# Altium schematic sheet DSR_Altium_Schematic_NOTTESTED.schdoc
size 320 x 219 mm
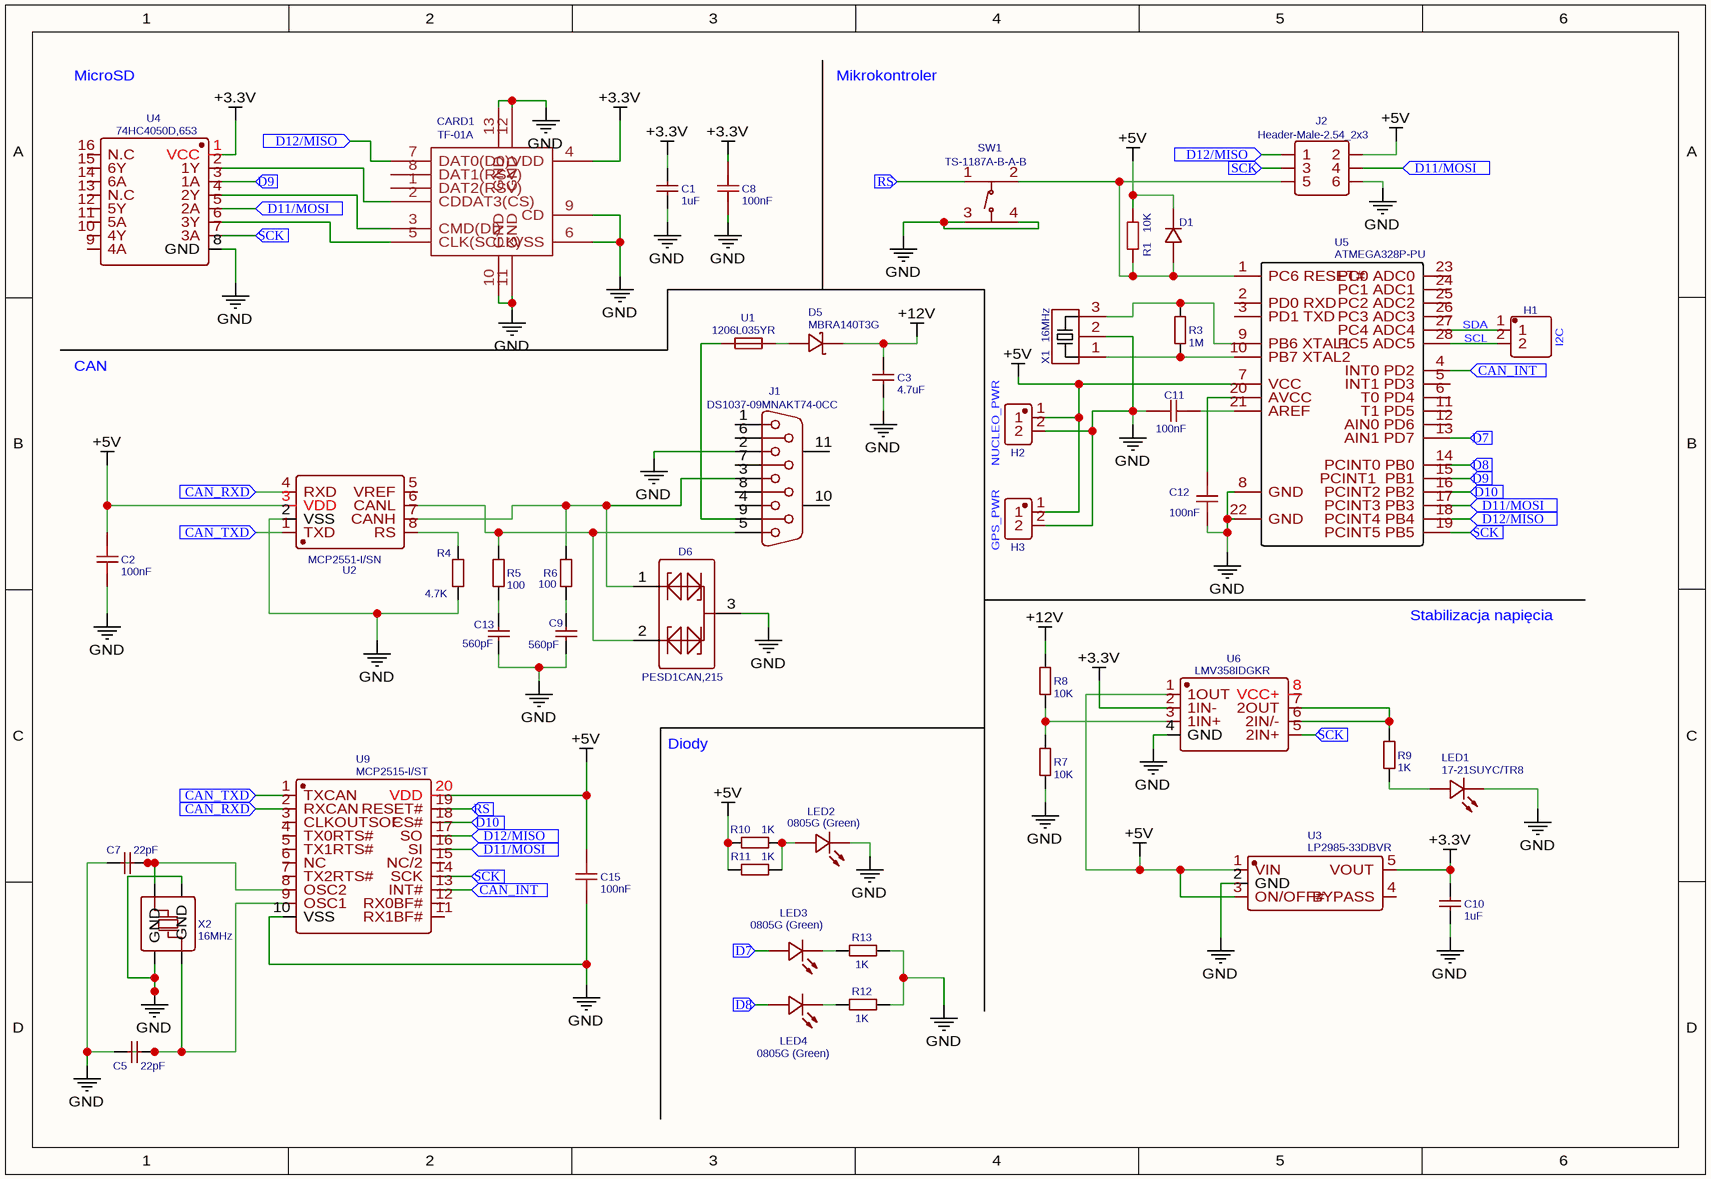
[diagram p0: DSR_Altium_Schematic_NOTTESTED.schdoc]

## Parts
C1  1uF  [C0603]
C2  100nF  [C0603]
C3  4.7uF  [C0603]
C5  22pF  [C0603]
C7  22pF  [C0603]
C8  100nF  [C0603]
C9  560pF  [C0603]
C10  1uF  [C0603]
C11  100nF  [C0603]
C12  100nF  [C0603]
C13  560pF  [C0603]
C15  100nF  [C0603]
CARD1  TF-01A  [TF-SMD_TF-01A]
D1  CD1206-S01575  [D1206-RD]  (value not drawn)
D5  MBRA140T3G  [SMA_L4.3-W2.6-LS5.2-RD]
D6  PESD1CAN,215  [SOT-23_L2.9-W1.3-P1.90-LS2.4-BR]
H1  210S-1*2P L=11.6MMGold-plated black  [HDR-TH_2P-P2.54-V-M-1]  (value not drawn)
H2  22850102ANG1SYA02  [HDR-TH_2P-P2.54-V-F]  (value not drawn)
H3  22850102ANG1SYA02  [HDR-TH_2P-P2.54-V-F]  (value not drawn)
J1  DS1037-09MNAKT74-0CC  [DB9-TH_DT10121-M5N3-4F]
J2  Header-Male-2.54_2x3  [HDR-TH_6P-P2.54-V-M-R2-C3-S2.54-1]
LED1  17-21SUYC/TR8  [LED0805-RD]
LED2  0805G (Green)  [LED0805-RD_GREEN]
LED3  0805G (Green)  [LED0805-RD_GREEN]
LED4  0805G (Green)  [LED0805-RD_GREEN]
R1  10K  [R0603]
R3  1M  [R0603]
R4  4.7K  [R0603]
R5  100  [R0603]
R6  100  [R0603]
R7  10K  [R0603]
R8  10K  [R0603]
R9  1K  [R0603]
R10  1K  [R0603]
R11  1K  [R0603]
R12  1K  [R0603]
R13  1K  [R0603]
SW1  TS-1187A-B-A-B  [SW-SMD_4P-L5.1-W5.1-P3.70-LS6.5-TL-2]
U1  1206L035YR  [F1206]
U2  MCP2551-I/SN  [SOIC-8_L4.9-W3.9-P1.27-LS6.0-BL]
U3  LP2985-33DBVR  [SOT-23-5_L2.9-W1.6-P0.95-LS2.8-TL]
U4  74HC4050D,653  [SOP-16_L10.0-W3.9-P1.27-LS6.0-BL]
U5  ATMEGA328P-PU  [DIP-28_L34.6-W7.3-P2.54-LS10.2-BL]
U6  LMV358IDGKR  [VSSOP-8_L3.0-W3.0-P0.65-LS5.0-BL]
U9  MCP2515-I/ST  [TSSOP-20_L6.5-W4.4-P0.65-LS6.4-BL]
X1  16MHz  [OSC-SMD_3P-L3.2-W1.3-P0.95-L]
X2  16MHz  [CRYSTAL-SMD_4P-L5.0-W3.2-BL]

## Ports
CAN_INT (in), CAN_RXD (in), CAN_TXD (in), D7 (in), D8 (in), D9 (in), D10 (in), D11/MOSI (in), D12/MISO (in), RS (in), SCK (in)

## Nets
+3.3V: C1.2 C8.2 C10.2 CARD1.4(VDD) U3.5(VOUT) U4.1(VCC) U6.2(1IN-)
+5V: C2.2 C15.2 D1.1(K) H2.1 H3.1 J2.2 R1.2 R10.2 R11.2 U2.3(VDD) U3.1(VIN) U3.3(ON/OFF#) U5.7(VCC) U6.1(1OUT) U9.20(VDD)
+12V: C3.2 D5.1(C) R8.2
GND: C1.1 C2.1 C3.1 C5.1 C7.1 C8.1 C9.1 C10.1 C11.2 C12.1 C13.1 C15.1 CARD1.6(VSS) CARD1.9(CD) CARD1.10(GND) CARD1.11(GND) CARD1.12(GND) CARD1.13(GND) D6.3 H2.2 H3.2 J1.2 J2.6 LED1.1(-) LED2.1(K) R4.2 R7.1 R12.2 R13.2 SW1.3(C) SW1.4(D) U2.2(VSS) U3.2(GND) U4.8(GND) U5.8(GND) U5.22(GND) U6.4(GND) U9.10(VSS) X1.2 X2.2(GND) X2.4(GND)
CAN_INT: U5.4(INT0_PD2) U9.13(INT#) ; port CAN_INT
CAN_RXD: U2.4(RXD) U9.2(RXCAN) ; port CAN_RXD
CAN_TXD: U2.1(TXD) U9.1(TXCAN) ; port CAN_TXD
D7: LED3.2(A) U5.13(AIN1_PD7) ; port D7
D8: LED4.2(A) U5.14(PCINT0_PB0) ; port D8
D9: U4.3(1A) U5.15(PCINT1__PB1) ; port D9
D10: U5.16(PCINT2_PB2) U9.18(CS#) ; port D10
D11/MOSI: J2.4 U4.5(2A) U5.17(PCINT3_PB3) U9.16(SI) ; port D11/MOSI
D12/MISO: CARD1.7(DAT0(D0)) J2.1 U5.18(PCINT4_PB4) U9.17(SO) ; port D12/MISO
RS: SW1.1(A) U9.19(RESET#) ; port RS
SCK: J2.3 U4.7(3A) U5.19(PCINT5_PB5) U6.5(2IN+) U9.14(SCK) ; port SCK
NetC5_2: C5.2 U9.9(OSC1) X2.1(OSC1)
NetC7_2: C7.2 U9.8(OSC2) X2.3(OSC2)
NetC9_2: C9.2 R6.1
NetC11_1: C11.1 U5.21(AREF)
NetC12_2: C12.2 U5.20(AVCC)
NetC13_2: C13.2 R5.1
NetCARD1_2: CARD1.2(CDDAT3(CS)) U4.2(1Y)
NetCARD1_3: CARD1.3(CMD(DI)) U4.4(2Y)
NetCARD1_5: CARD1.5(CLK(SCLK)) U4.6(3Y)
NetD1_2: D1.2(A) J2.5 R1.1 SW1.2(B) U5.1(PC6_RESET#)
NetD5_2: D5.2(A) U1.2
NetD6_1: D6.1 J1.3 R6.2 U2.7(CANH)
NetD6_2: D6.2 J1.5 R5.2 U2.6(CANL)
NetH1_1: H1.1 U5.27(PC4_ADC4)
NetH1_2: H1.2 U5.28(PC5_ADC5)
NetJ1_9: J1.9 U1.1
NetLED1_2: LED1.2(+) R9.1
NetLED2_2: LED2.2(A) R10.1 R11.1
NetLED3_1: LED3.1(K) R13.1
NetLED4_1: LED4.1(K) R12.1
NetR3_1: R3.1 U5.10(PB7_XTAL2) X1.1
NetR3_2: R3.2 U5.9(PB6_XTAL1) X1.3
NetR4_1: R4.1 U2.8(RS)
NetR7_2: R7.2 R8.1 U6.3(1IN+)
NetR9_2: R9.2 U6.6(2IN/-) U6.7(2OUT)

Not connected (* = marked no-connect by the designer): CARD1 1(DAT2(RSV)) 8(DAT1(RSV)); J1 1 4 6 7 8 10(MH1) 11(MH2); U2 5(VREF); U3 4(BYPASS); U4 9(4A) 10(4Y) 11(5A) 12(5Y) 13(N.C) 14(6A) 15(6Y) 16(N.C); U5 2(PD0_RXD) 3(PD1_TXD) 5(INT1_PD3) 6(T0_PD4) 11(T1_PD5) 12(AIN0_PD6) 23(PC0_ADC0) 24(PC1_ADC1) 25(PC2_ADC2) 26(PC3_ADC3); U6 8(VCC+); U9 3(CLKOUTSOF) 4(TX0RTS#) 5(TX1RTS#) 6(NC) 7(TX2RTS#) 11(RX1BF#) 12(RX0BF#) 15(NC/2)

## Notes on the sheet
- MicroSD
- Mikrokontroler
- CAN
- (near H2) NUCLEO_PWR
- SDA
- SCL
- (near H1) I2C
- (near H3) GPS_PWR
- Stabilizacja napięcia
- Diody

## Library data of the parts
C1 C10 = 1uF: BOM_Manufacturer Part: CL10A105KB8NNNC; BOM_Manufacturer: SAMSUNG; nameAlias: Capacitance; BOM_Supplier: LCSC; BOM_Supplier Part: C15849; BOM_JLCPCB Part Class: Basic Part; spicePre: C; spiceSymbolName: CL10A105KB8NNNC
C2 C8 C11 C12 C15 = 100nF: BOM_Manufacturer: YAGEO; BOM_Manufacturer Part: CC0603KRX7R9BB104; nameAlias: Capacitance; BOM_Supplier: LCSC; BOM_Supplier Part: C14663; BOM_JLCPCB Part Class: Basic Part; spicePre: C; spiceSymbolName: CC0603KRX7R9BB104
C3 = 4.7uF: BOM_Manufacturer Part: CL10A475KO8NNNC; BOM_Manufacturer: SAMSUNG; nameAlias: Capacitance; BOM_Supplier: LCSC; BOM_Supplier Part: C19666; BOM_JLCPCB Part Class: Basic Part; spicePre: C; spiceSymbolName: CL10A475KO8NNNC
C5 C7 = 22pF: BOM_Manufacturer Part: CL10C220JB8NNNC; BOM_Manufacturer: SAMSUNG; nameAlias: Capacitance; BOM_Supplier: LCSC; BOM_Supplier Part: C1653; BOM_JLCPCB Part Class: Basic Part; spicePre: C; spiceSymbolName: CL10C220JB8NNNC
C9 C13 = 560pF: BOM_Manufacturer: SAMSUNG; BOM_Manufacturer Part: CL10B561KB8NNNC; nameAlias: Capacitance; BOM_Supplier: LCSC; BOM_Supplier Part: C84721; BOM_JLCPCB Part Class: Extended Part; spicePre: C; spiceSymbolName: CL10B561KB8NNNC
CARD1 = TF-01A: BOM_Manufacturer: HRO; BOM_Supplier: LCSC; BOM_Manufacturer Part: TF-01A; BOM_Supplier Part: C91145; BOM_JLCPCB Part Class: Extended Part; spicePre: C; spiceSymbolName: TF-01A
D1 = CD1206-S01575: BOM_Manufacturer: BOURNS; Contributor: LCSC; BOM_Supplier: LCSC; BOM_Supplier Part: C75465; BOM_Manufacturer Part: CD1206-S01575; BOM_JLCPCB Part Class: Extended Part; spicePre: D; spiceSymbolName: CD1206-S01575
D5 = MBRA140T3G: BOM_Manufacturer: ON; Contributor: LCSC; BOM_Supplier: LCSC; BOM_Manufacturer Part: MBRA140T3G; BOM_Supplier Part: C54798; BOM_JLCPCB Part Class: Extended Part; spicePre: D; spiceSymbolName: MBRA140T3G
D6 = PESD1CAN,215: BOM_Manufacturer: Nexperia; BOM_Supplier: LCSC; BOM_Manufacturer Part: PESD1CAN,215; BOM_Supplier Part: C15771; BOM_JLCPCB Part Class: Extended Part; spicePre: D; spiceSymbolName: PESD1CAN,215
H1 = 210S-1*2P L=11.6MMGold-plated black: BOM_Manufacturer: Ckmtw; Contributor: LCSC; BOM_Supplier: LCSC; BOM_Manufacturer Part: 210S-1*2P L=11.6MMGold-plated black; BOM_Supplier Part: C124375; BOM_JLCPCB Part Class: Extended Part; spicePre: H; spiceSymbolName: 210S-1*2P L=11.6MMGold-plated black
H2 H3 = 22850102ANG1SYA02: BOM_Manufacturer: JILN; Contributor: LCSC; BOM_Supplier: LCSC; BOM_Supplier Part: C429966; BOM_Manufacturer Part: 22850102ANG1SYA02; BOM_JLCPCB Part Class: Extended Part; spicePre: H; spiceSymbolName: 22850102ANG1SYA02
J1 = DS1037-09MNAKT74-0CC: BOM_Manufacturer: CONNFLY; BOM_Supplier: LCSC; BOM_Manufacturer Part: DS1037-09MNAKT74-0CC; BOM_Supplier Part: C75750; BOM_JLCPCB Part Class: Extended Part; spicePre: J; spiceSymbolName: DS1037-09MNAKT74-0CC
J2 = Header-Male-2.54_2x3: BOM_Manufacturer: BOOMELE; BOM_Supplier: LCSC; BOM_Manufacturer Part: Header-Male-2.54_2x3; BOM_Supplier Part: C65114; BOM_JLCPCB Part Class: Extended Part; spicePre: J; spiceSymbolName: Header-Male-2.54_2x3
LED1 = 17-21SUYC/TR8: BOM_Manufacturer: KENTO; BOM_Supplier: LCSC; BOM_Manufacturer Part: 17-21SUYC/TR8; BOM_Supplier Part: C2296; BOM_JLCPCB Part Class: Basic Part; spicePre: L; spiceSymbolName: 17-21SUYC/TR8
LED2-LED4 = 0805G (Green): BOM_Manufacturer: KENTO; BOM_Supplier: LCSC; BOM_Manufacturer Part: 0805G (Green); BOM_Supplier Part: C2297; BOM_JLCPCB Part Class: Basic Part; spicePre: L; spiceSymbolName: 0805G (Green)
R1 = 10K: BOM_Manufacturer: Tyohm; BOM_Manufacturer Part: RMC060310K1%N; nameAlias: Resistance (Ohms); Contributor: LCSC; BOM_Supplier: LCSC; BOM_Supplier Part: C269701; BOM_JLCPCB Part Class: Extended Part; spicePre: R; spiceSymbolName: RMC060310K1%N
R3 = 1M: BOM_Manufacturer: UniOhm; BOM_Manufacturer Part: 0603WAF1004T5E; nameAlias: Resistance (Ohms); BOM_Supplier: LCSC; BOM_Supplier Part: C22935; BOM_JLCPCB Part Class: Basic Part; spicePre: R; spiceSymbolName: 0603WAF1004T5E
R4 = 4.7K: BOM_Manufacturer: UniOhm; BOM_Manufacturer Part: 0603WAF4701T5E; nameAlias: Resistance (Ohms); BOM_Supplier: LCSC; BOM_Supplier Part: C23162; BOM_JLCPCB Part Class: Basic Part; spicePre: R; spiceSymbolName: 0603WAF4701T5E
R5 R6 = 100: BOM_Manufacturer: UniOhm; BOM_Manufacturer Part: 0603WAF1000T5E; nameAlias: Resistance (Ohms); BOM_Supplier: LCSC; BOM_Supplier Part: C22775; BOM_JLCPCB Part Class: Basic Part; spicePre: R; spiceSymbolName: 0603WAF1000T5E
R7 R8 = 10K: BOM_Manufacturer: UniOhm; BOM_Manufacturer Part: 0603WAF1002T5E; nameAlias: Resistance (Ohms); BOM_Supplier: LCSC; BOM_Supplier Part: C25804; BOM_JLCPCB Part Class: Basic Part; spicePre: R; spiceSymbolName: 0603WAF1002T5E
R9-R13 = 1K: BOM_Manufacturer: UniOhm; BOM_Manufacturer Part: 0603WAF1001T5E; nameAlias: Resistance (Ohms); BOM_Supplier: LCSC; BOM_Supplier Part: C21190; BOM_JLCPCB Part Class: Basic Part; spicePre: R; spiceSymbolName: 0603WAF1001T5E
SW1 = TS-1187A-B-A-B: BOM_Manufacturer: XKB Enterprise; Contributor: LCSC; BOM_Supplier: LCSC; BOM_Supplier Part: C318884; BOM_Manufacturer Part: TS-1187A-B-A-B; BOM_JLCPCB Part Class: Extended Part; spicePre: S; spiceSymbolName: TS-1187A-B-A-B
U1 = 1206L035YR: BOM_Manufacturer: Littelfuse; BOM_Supplier: LCSC; BOM_Manufacturer Part: 1206L035YR; BOM_Supplier Part: C99562; BOM_JLCPCB Part Class: Extended Part; spicePre: U; spiceSymbolName: 1206L035YR
U2 = MCP2551-I/SN: BOM_Manufacturer: MICROCHIP; BOM_Supplier: LCSC; BOM_Manufacturer Part: MCP2551-I/SN; BOM_Supplier Part: C7376; BOM_JLCPCB Part Class: Extended Part; spicePre: U; spiceSymbolName: MCP2551-I/SN
U3 = LP2985-33DBVR: BOM_Manufacturer: TI; BOM_Supplier: LCSC; BOM_Manufacturer Part: LP2985-33DBVR; BOM_Supplier Part: C95414; BOM_JLCPCB Part Class: Extended Part; spicePre: U; spiceSymbolName: LP2985-33DBVR
U4 = 74HC4050D,653: BOM_Manufacturer: Nexperia; spicePre: X; BOM_Supplier: LCSC; BOM_Manufacturer Part: 74HC4050D,653; BOM_Supplier Part: C43181; BOM_JLCPCB Part Class: Extended Part; spiceSymbolName: 74HC4050D,653
U5 = ATMEGA328P-PU: BOM_Manufacturer: MICROCHIP; sourceId: Oic6oiASL; Contributor: LCSC; timeStamp: 1451725987; BOM_Supplier: LCSC; BOM_Manufacturer Part: ATMEGA328P-PU; BOM_Supplier Part: C33901; BOM_JLCPCB Part Class: Extended Part; spicePre: U; spiceSymbolName: ATMEGA328P-PU
U6 = LMV358IDGKR: BOM_Manufacturer: TI; BOM_Supplier: LCSC; BOM_Manufacturer Part: LMV358IDGKR; BOM_Supplier Part: C105242; BOM_JLCPCB Part Class: Extended Part; spicePre: U; spiceSymbolName: LMV358IDGKR
U9 = MCP2515-I/ST: BOM_Manufacturer: MICROCHIP; BOM_Supplier: LCSC; BOM_Manufacturer Part: MCP2515-I/ST; BOM_Supplier Part: C15193; BOM_JLCPCB Part Class: Extended Part; spicePre: U; spiceSymbolName: MCP2515-I/ST
X1 = 16MHz: BOM_Manufacturer: MuRata; BOM_Manufacturer Part: CSTCE16M0V53-R0; nameAlias: Frequency; BOM_Supplier: LCSC; BOM_Supplier Part: C32180; BOM_JLCPCB Part Class: Extended Part; spicePre: X; spiceSymbolName: CSTCE16M0V53-R0
X2 = 16MHz: BOM_Manufacturer: ZheJiang East Crystal Elec; BOM_Manufacturer Part: K16000J030; nameAlias: Frequency; Contributor: LCSC; BOM_Supplier: LCSC; BOM_Supplier Part: C258963; BOM_JLCPCB Part Class: Extended Part; spicePre: X; spiceSymbolName: K16000J030